# EAGLE design +XPanelNew (EAGLE 6.1)
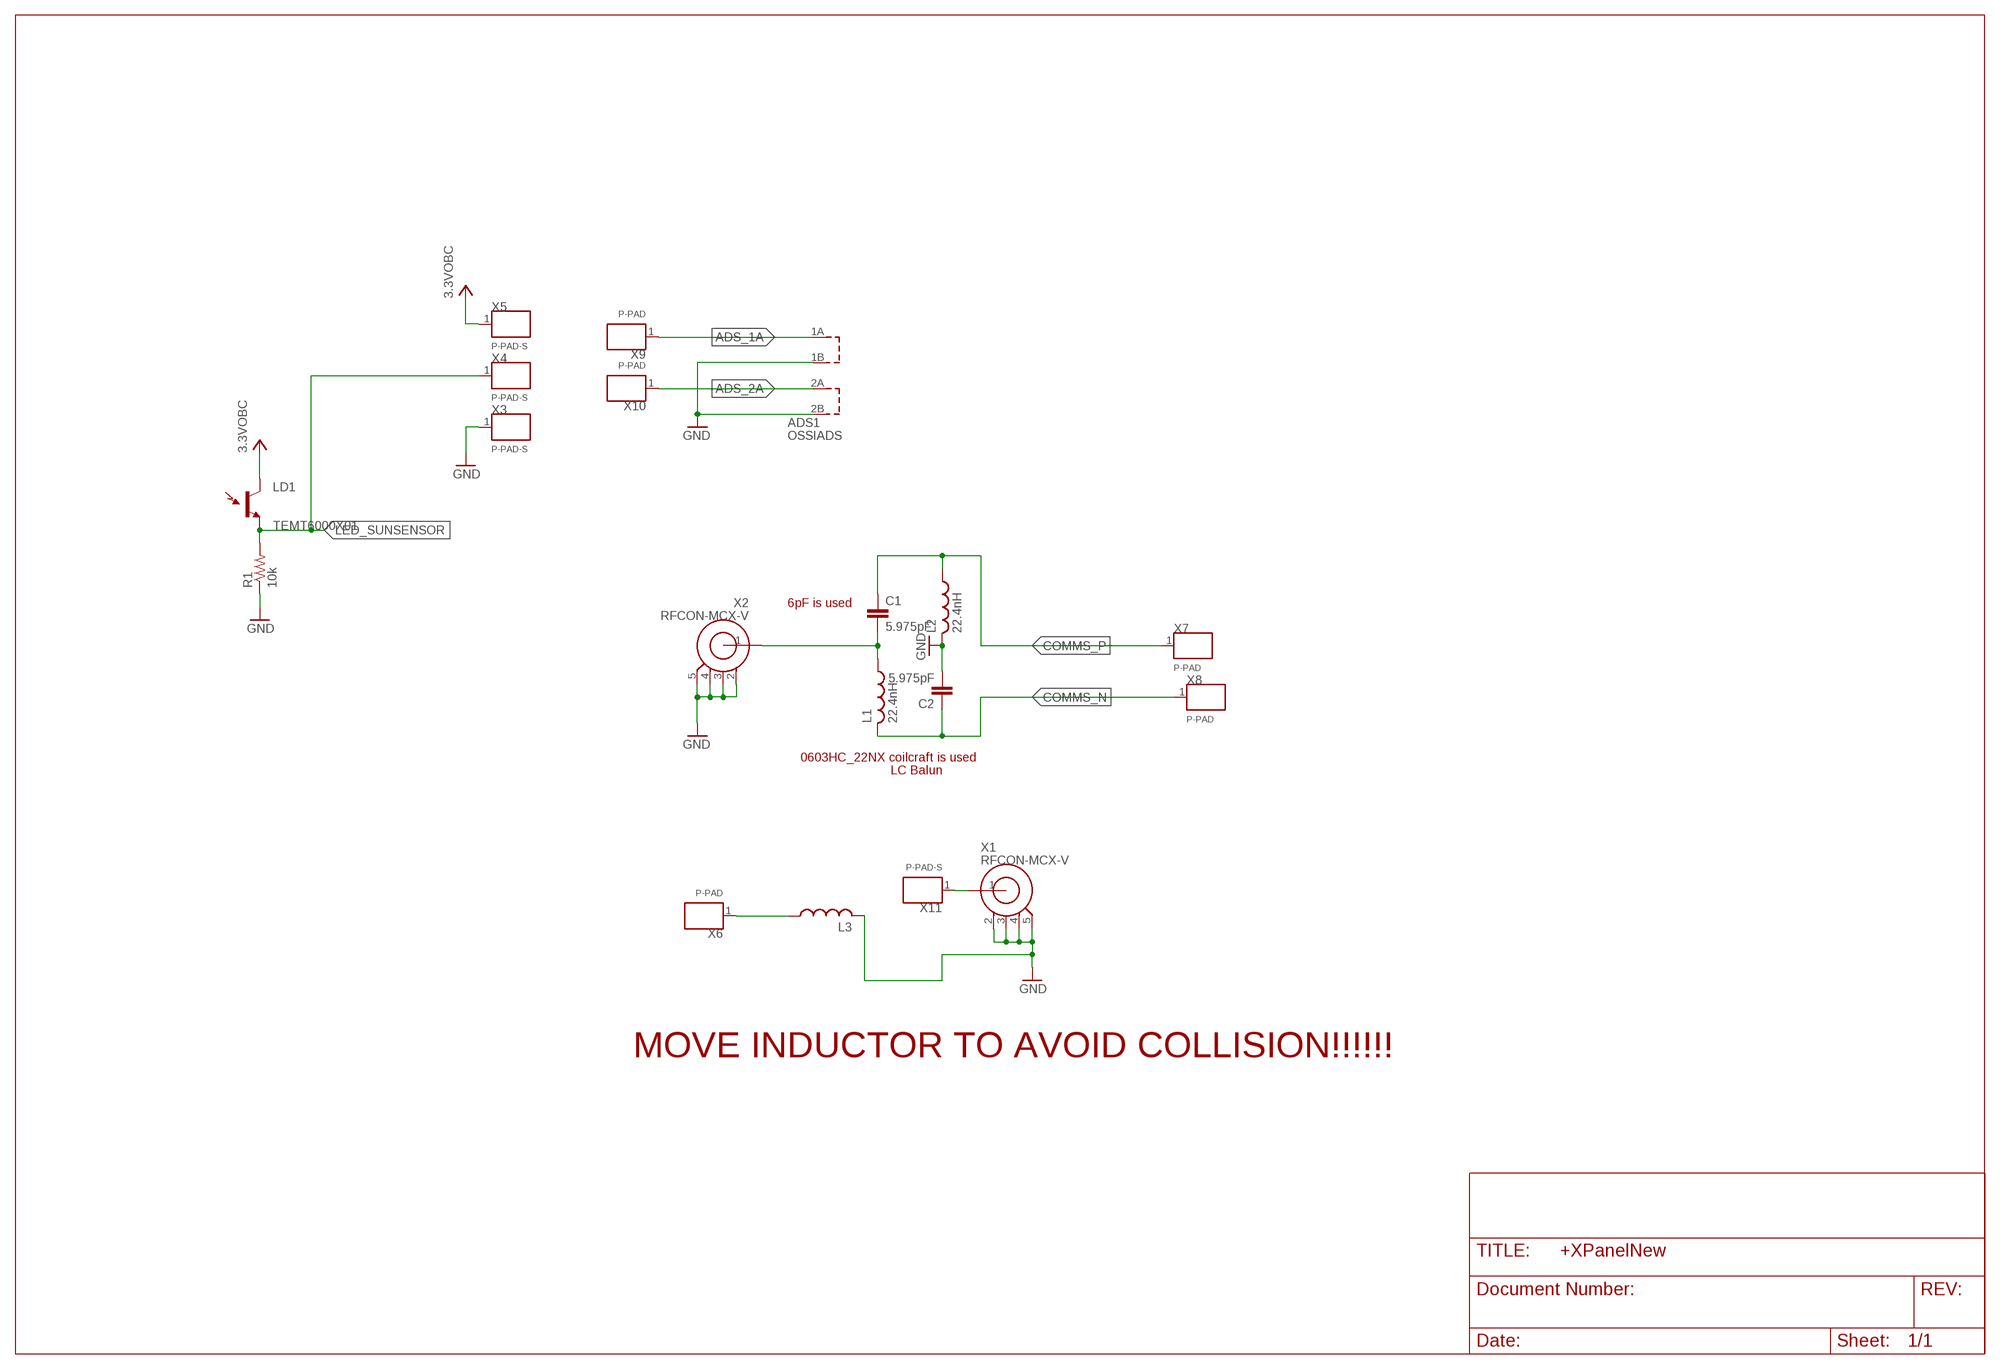
[diagram p0: schematic, sheet 1]

## Parts
ADS1  OSSIADS  [OSSIADS]
C1  5.975pF  C0805(2012)  [C0805(2012)]
C2  5.975pF  C0805(2012)  [C0805(2012)]
L1  22.4nH  L0805(2012)  [L0805(2012)]
L2  22.4nH  L0805(2012)  [L0805(2012)]
L3  L-US0207/10  [0207/10]
LD1  TEMT6000X01  [TEMT6000-SEN]
R1  10k  R0805(2012)  [R0805(2012)]
X1  RFCON-MCX-V  [MCX-V]
X2  RFCON-MCX-V  [MCX-V]
X3  P-PAD-S  [P-PAD-S]
X4  P-PAD-S  [P-PAD-S]
X5  P-PAD-S  [P-PAD-S]
X6  P-PAD  [P-PAD]
X7  P-PAD  [P-PAD]
X8  P-PAD  [P-PAD]
X9  P-PAD  [P-PAD]
X10  P-PAD  [P-PAD]
X11  P-PAD-S  [P-PAD-S]

## Nets
3.3VOBC: LD1.COLLECTOR(C1) X5.1
ADS_1A: ADS1.1A X9.1
ADS_2A: ADS1.2A X10.1
COMMS_N: C2.1 L1.2 X8.1
COMMS_P: C1.1 L2.1 X7.1
GND: ADS1.1B ADS1.2B C2.2 L2.2 L3.2 R1.1 X1.2 X1.3 X1.4 X1.5 X2.2 X2.3 X2.4 X2.5 X3.1
LED_SUNSENSOR: LD1.EMITTER(E1) R1.2 X4.1
N$1: L3.1 X6.1
N$2: X1.1 X11.1
N$45: C1.2 L1.1 X2.1

## Notes on the sheet
- 6pF is used
- 0603HC_22NX coilcraft is used
- LC Balun
- MOVE INDUCTOR TO AVOID COLLISION!!!!!!

## Library data of the parts
ADS1 = OSSI:OSSIADS
C1 C2 = OSSI:C
L1 L2 = OSSI:L
L3 = rcl:L-US: INDUCTOR, American symbol
LD1 = OSSI:TEMT6000: Ambient Light Sensor Simple light detection sensor. Output varies with light intensity input. Spark Fun Electronics SKU : COM-08348
R1 = OSSI:R
X1 X2 = OSSI:RFCON: RF Connectors
X3-X11 = OSSI:P-PAD

## Board
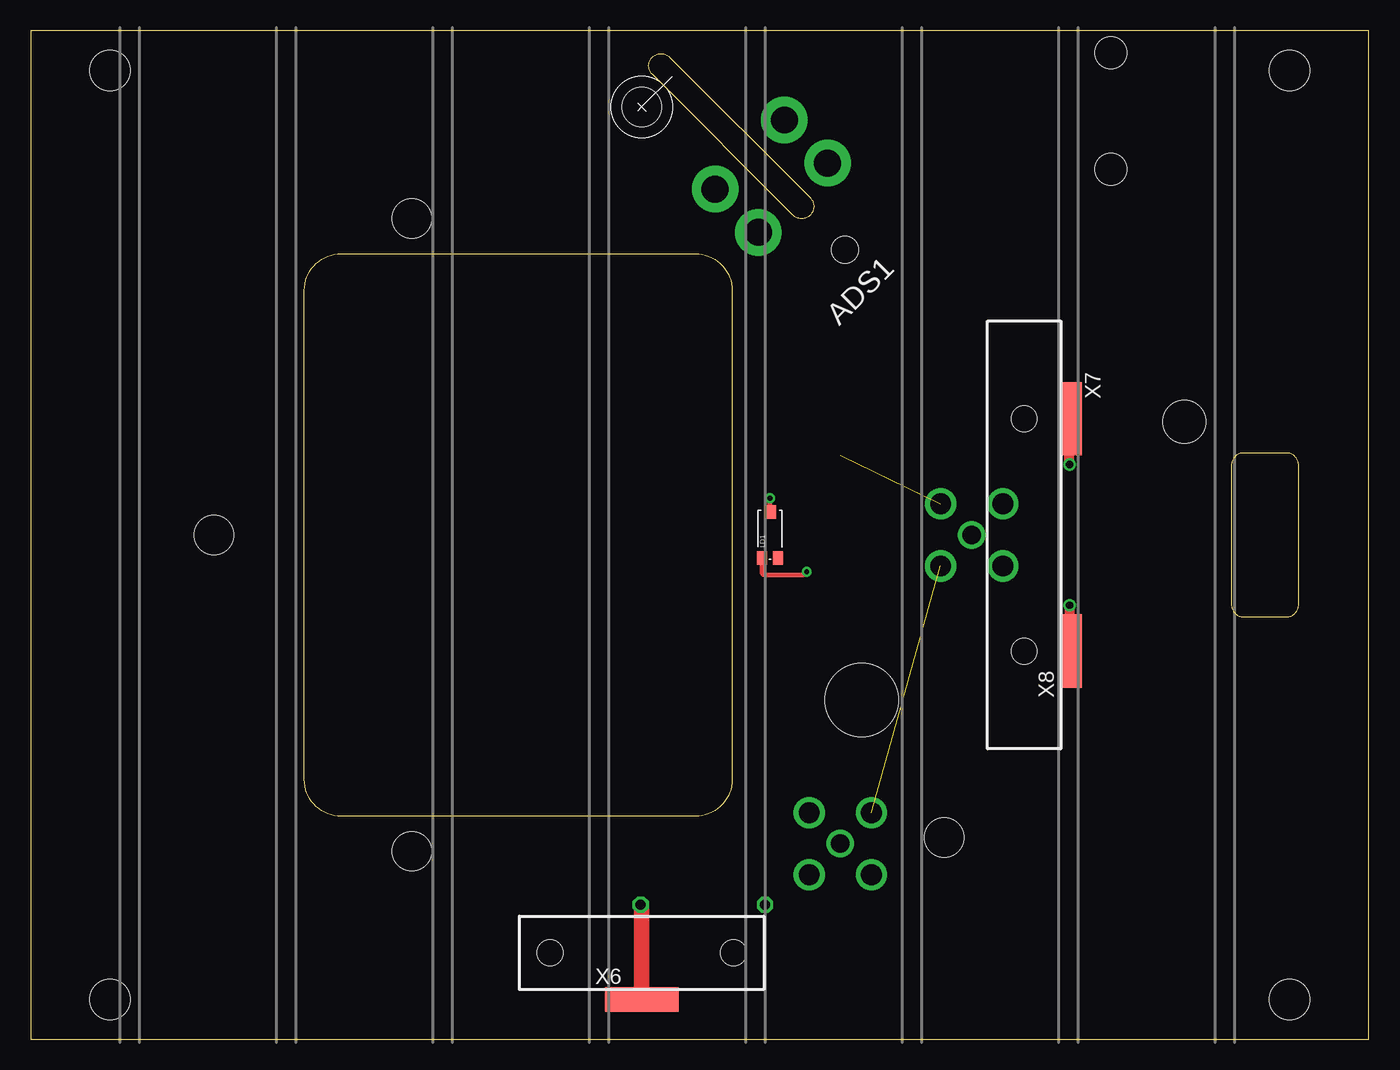
[diagram p1: board, top side]
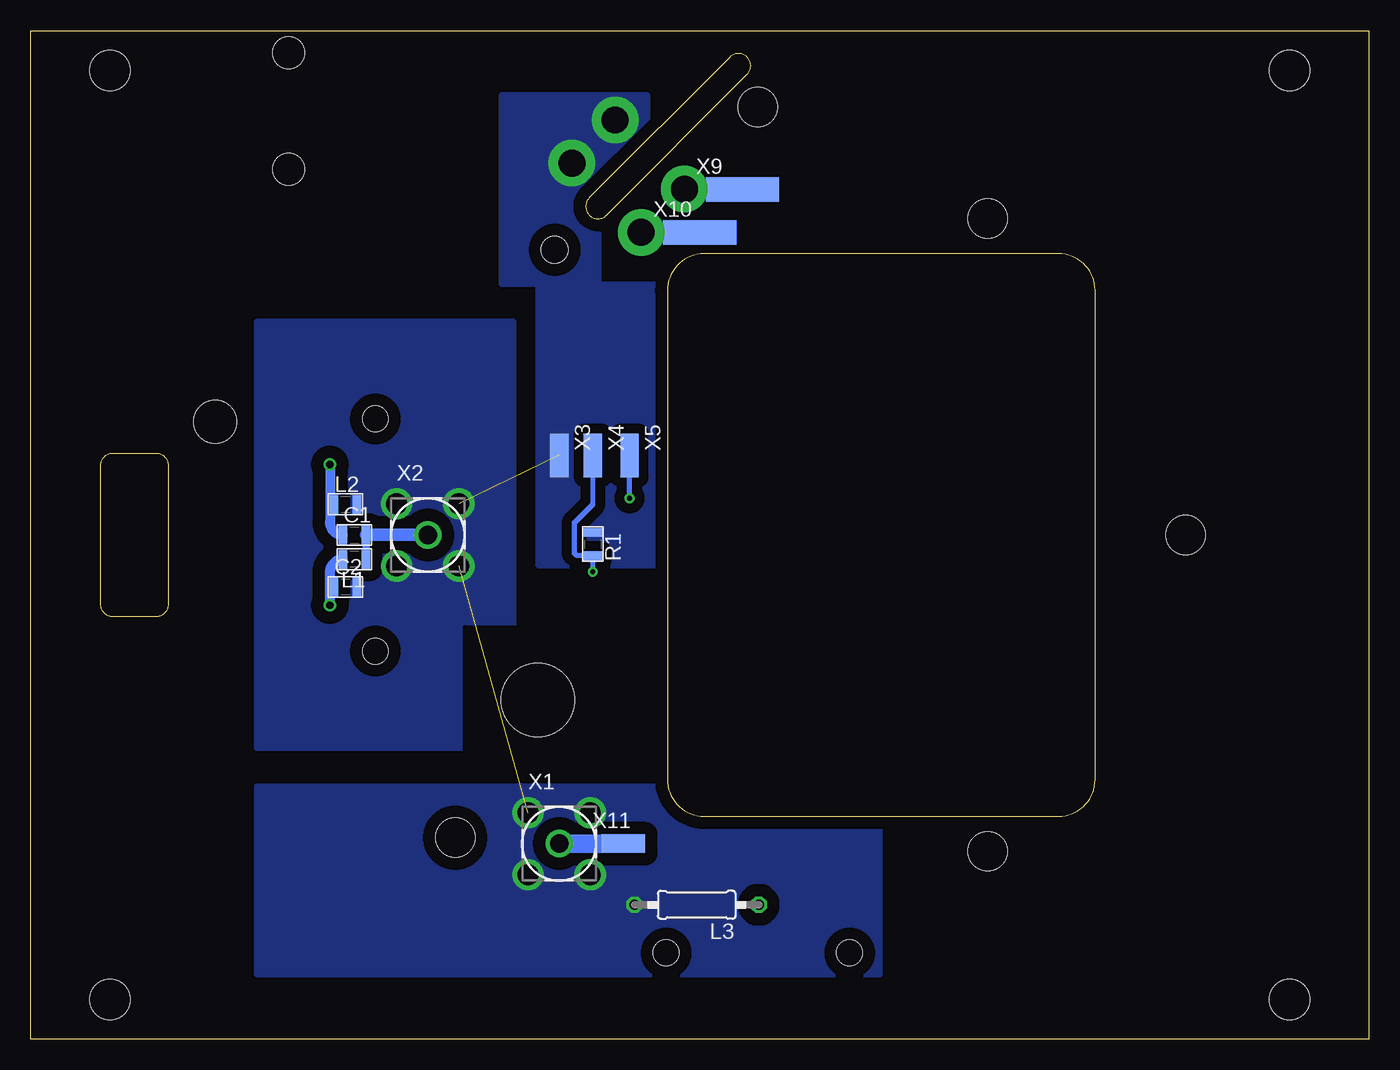
[diagram p2: board, bottom side, seen from below]

Size 109.5 x 82.5 mm. Coordinates in mm from the lower left corner, seen from the top.
Outline: 0,0 109.5,0 109.5,82.5 0,82.5 0,0
Outline: 25.4,64.25 54.4,64.25 arc-90 57.4,61.25 57.4,21.25 arc-90 54.4,18.25 25.4,18.25 arc-90 22.4,21.25 22.4,61.25 arc-90 25.4,64.25
Outline: 99.25,34.55 102.75,34.55 arc90 103.75,35.55 103.75,46.95 arc90 102.75,47.95 99.25,47.95 arc90 98.25,46.95 98.25,35.55 arc90 99.25,34.55
Copper layers (1*16): Top 0.035mm / dielectric 1.5mm / Bottom 0.035mm
Design rules: minimum track width 10mil, minimum drill 24mil, track to track 8mil, track to pad 8mil, pad to pad 8mil, via to via 8mil, smd to smd 8mil, copper to edge 40mil, drill to drill 8mil, minimum pad ring 10mil, minimum via ring 8mil, stop-mask expansion 4mil, vias tented up to drill 0mil, thermal gap 10mil
Holes 3.2 mm at 31.2,67.12 50,76.25 15,41.25 31.2,15.38 74.75,16.5
Holes 2.1 mm at 42.5,7.07 57.5,7.07 81.29,31.75 81.29,50.75
Holes 3.3 mm at 6.5,3.25 6.5,79.25 103,79.25 103,3.25
Holes 2.6 mm at 88.4,71.15 88.4,80.68
Holes 6 mm at 68,27.75
Holes 3.5 mm at 94.4,50.5

### Footprints (pad centres in the part's own frame; a part is rotated, then mirrored left to right if it is on the bottom)
OSSIADS = drill 2.2 pad 3.81: 1A -0.5,-9; 1B 7.5,-9; 2A -0.5,-14; 2B 7.5,-14 | hole 2.2: 3.5,-20
C0805(2012) = smd 0.7 x 1.5: 1 -0.95,0; 2 0.95,0
L0805(2012) = smd 0.7 x 1.5: 1 -0.95,0; 2 0.95,0
0207/10 = drill 0.813 octagon: 1 -5.08,0; 2 5.08,0
TEMT6000-SEN = smd 1.1 x 0.8: BASE -1.87,-0.65; EMITTER -1.87,0.65 | smd 1.1 x 1: COLLECTOR 1.86,0.01
R0805(2012) = smd 0.7 x 1.5: 1 -0.95,0; 2 0.95,0
MCX-V = drill 1.5: 1 0,0 | drill 1.7: 2 -2.54,2.54; 3 2.54,2.54; 4 2.54,-2.54; 5 -2.54,-2.54
P-PAD-S = smd 3.556 x 1.5: 1 0,0
P-PAD = smd 6 x 2: 1 0,0

### Placement (x,y rotation side)
ADS1  50,76.25 45 top
C1  83,41.25 0 bottom
C2  83.75,37 0 bottom
L1  83,39.25 180 bottom
L2  83.75,43.75 0 bottom
L3  55,11 180 bottom
LD1  60.5,41.25 90 top
R1  63.5,40.5 270 bottom
X1  66.25,16 0 bottom
X2  77,41.25 0 bottom
X3  66.25,47.75 270 bottom
X4  63.5,47.75 270 bottom
X5  60.5,47.75 270 bottom
X6  50,3.25 0 top
X7  85,50.75 270 top
X8  85,31.75 90 top
X9  51.25,69.5 0 bottom
X10  54.75,66 0 bottom
X11  61,16 0 bottom

### Tracks (layer width: path | path; a pad name or v marks a point on that pad's centre or on a via)
3.3VOBC  (via drill 0.4)
  Top 0.406: LD1.COLLECTOR v60.5,44.25
  Bottom 0.406: v60.5,44.25 X5.1
ADS_1A
  Bottom 0.406: X9.1 56.01,69.5 ADS1.1A
ADS_2A
  Bottom 0.406: X10.1 59,66 | ADS1.2A 59,66 | 59,66 59,65.75
COMMS_N  (via drill 0.61)
  Top 0.813: v85,35.5 X8.1
  Bottom 0.254: C2.1 84.7,37.45 arc-90 85,37.75
  Bottom 0.813: v85,35.5 85,37.75 85,38.2 arc90 L1.2
COMMS_P  (via drill 0.61)
  Top 0.813: v85,47 X7.1
  Bottom 0.254: 85,42.3 85,43.45 arc90 L2.1
  Bottom 0.813: v85,47 85,42.3 arc-90 C1.1
GND  (2 unrouted)
  pour Bottom (isolate 1.016, no thermals): 40,18.75 40,8.75 40,8.75 40,5.25 91,5.25 91,8.75 91,8.75 91,20.75 57.5,20.75 57.5,18.75
  pour Bottom (isolate 0.813, no thermals): 59,77.25 71,77.25 71,72.75 71,72.75 71,61.75 68,61.75 68,38.75 58,38.75 58,61.75 63,61.75 63,69.75 59,73.75
  pour Bottom (isolate 1.016, no thermals): 70,58.75 70,23.75 91,23.75 91,58.75
LED_SUNSENSOR  (via drill 0.4)
  Top 0.406: LD1.EMITTER 59.85,38.15 60,38 63.25,38 v63.5,38.25
  Bottom 0.406: X4.1 63.5,43.75 65,42.25 65,39.75 64.8,39.55 R1.2 v63.5,38.25
N$1
  Top 1.27: L3.1 50,11 X6.1
N$2
  Bottom 1.5: X1.1 X11.1
N$3
  cutout Bottom: 62,33.75 62,21.75 74,21.75 74,33.75
N$45
  Bottom 0.61: L1.1 C1.2
  Bottom 1.016: C1.2 X2.1